# Altium schematic sheet Waveform Generator.SchDoc
size 406 x 304 mm; SheetNumber: 6; SheetTotal: 8
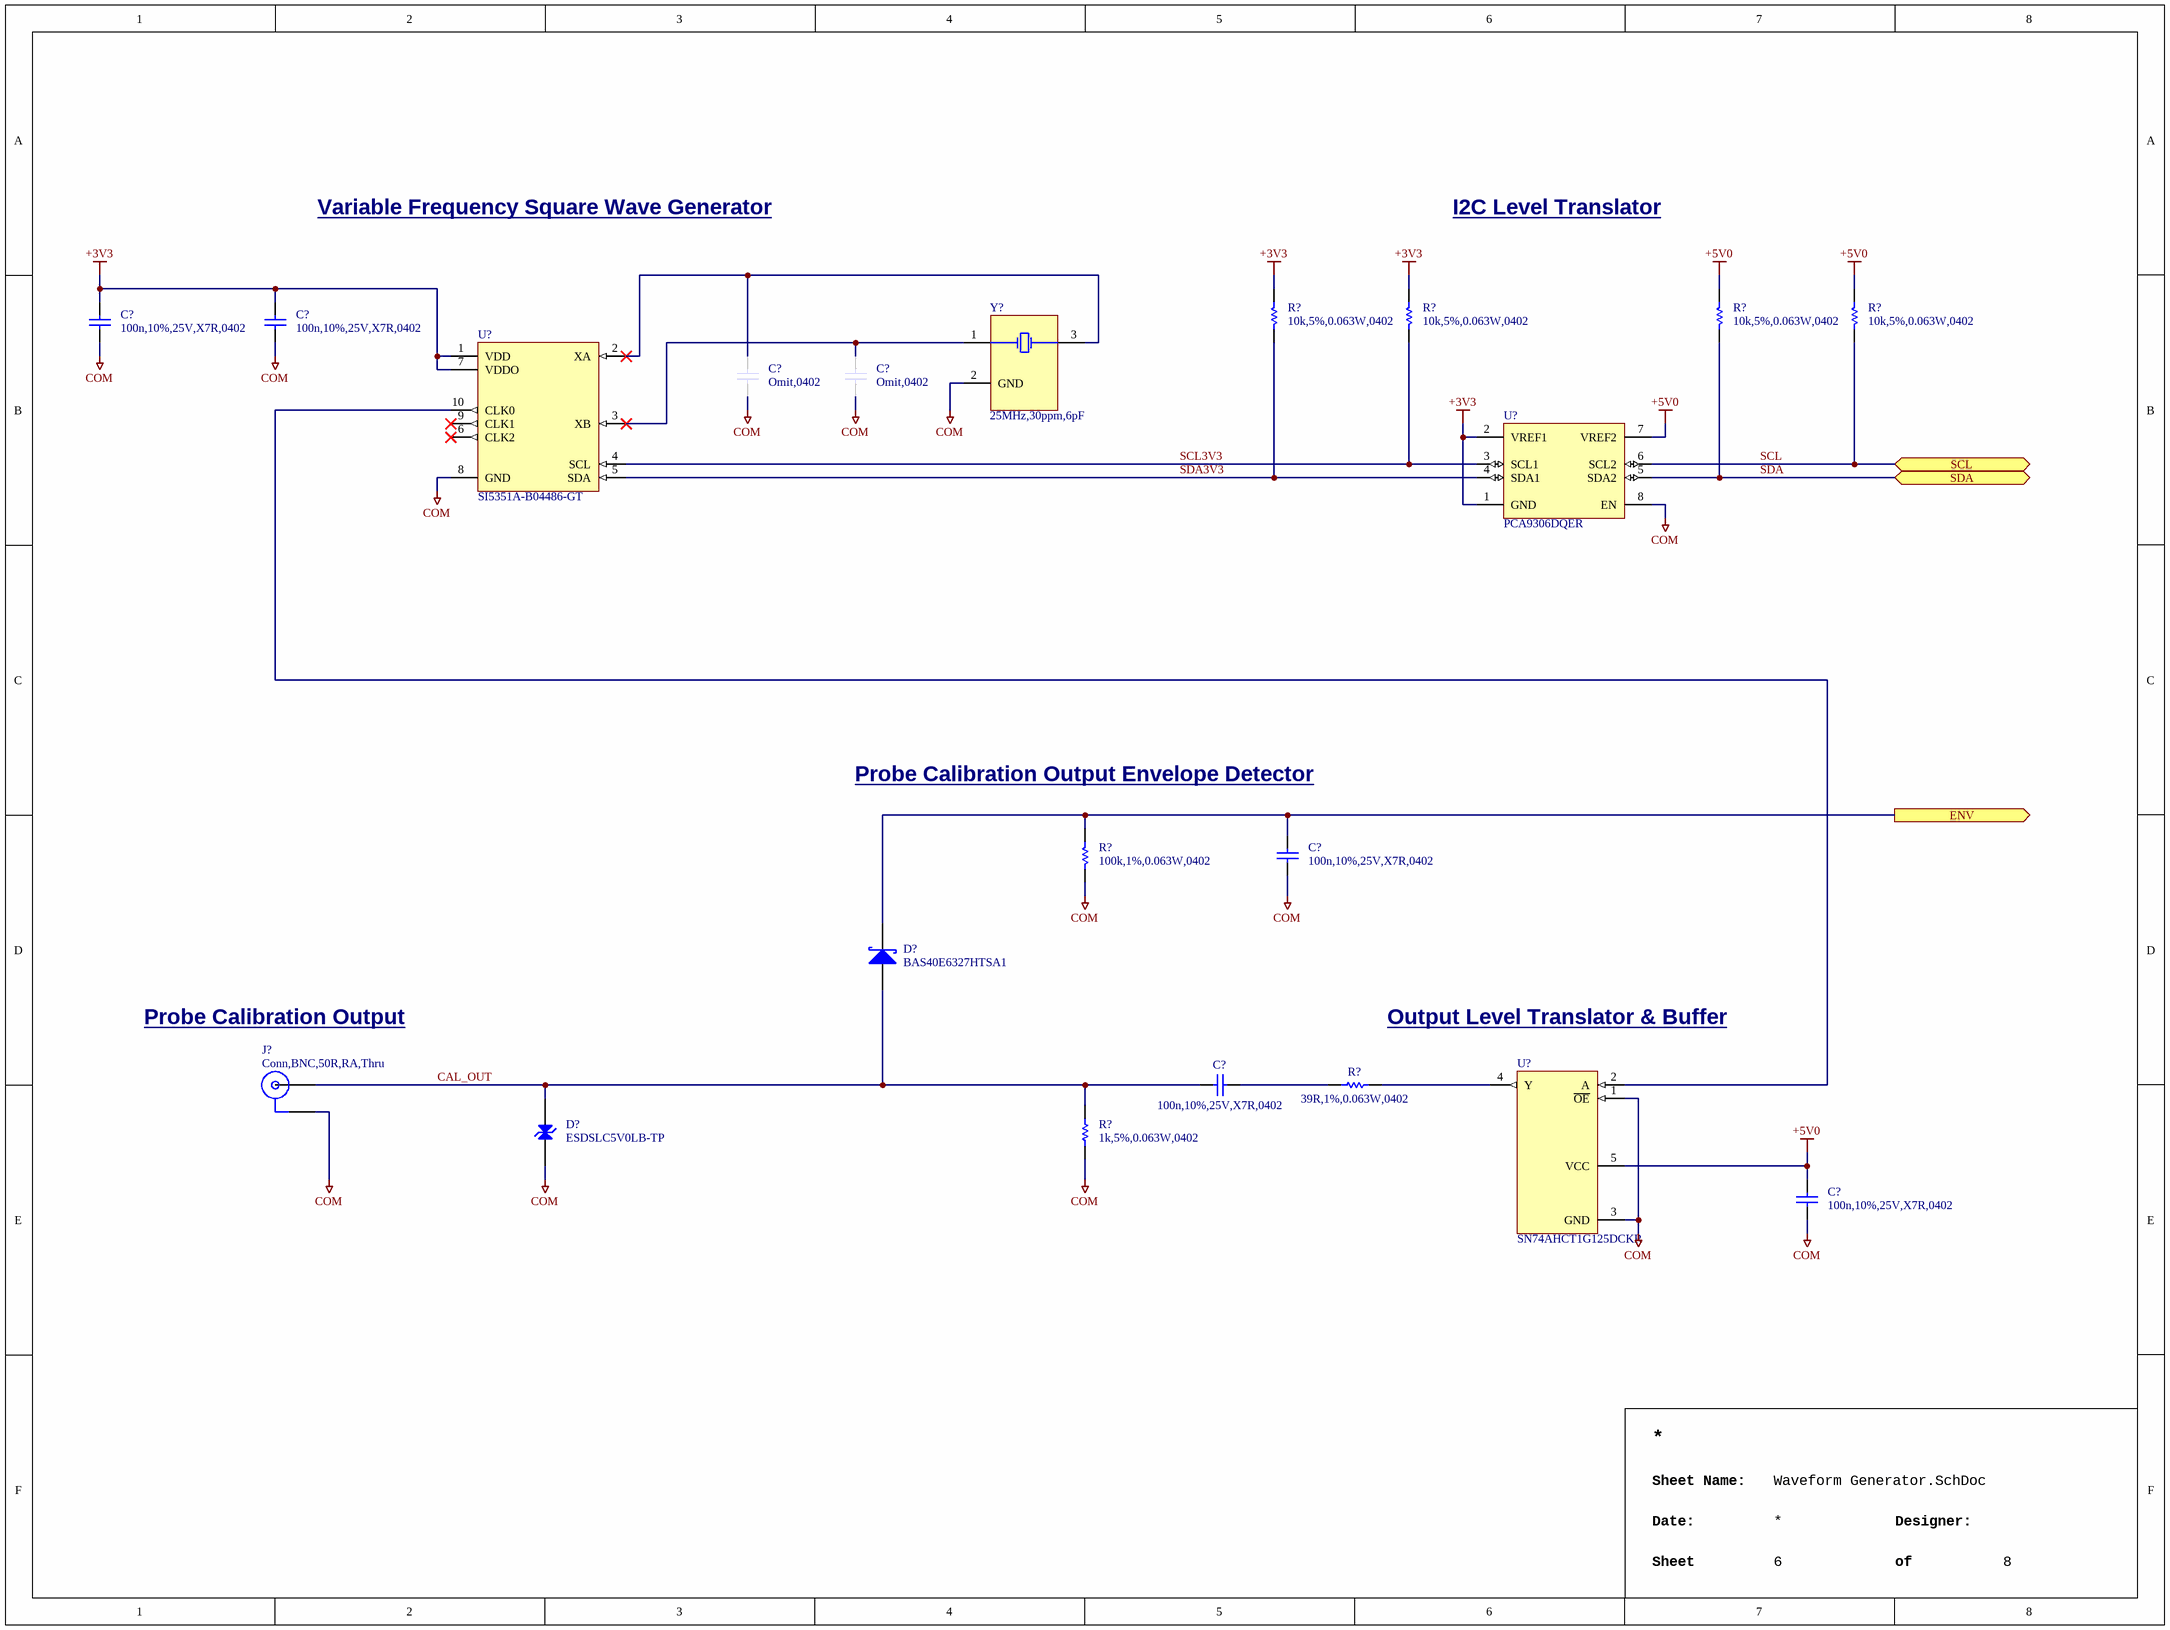
[diagram p0: Waveform Generator.SchDoc]

## Parts
(Parts that share a designator on the sheet are numbered #1, #2 ... from top to bottom, then left to right.)
C?#1  100n,10%,25V,X7R,0402  [CAPC1005X06N]
C?#2  100n,10%,25V,X7R,0402  [CAPC1005X06N]
C?#3  Omit,0402  [CAPC1005X06N]  (no BOM)
C?#4  Omit,0402  [CAPC1005X06N]  (no BOM)
C?#5  100n,10%,25V,X7R,0402  [CAPC1005X06N]
C?#6  100n,10%,25V,X7R,0402  [CAPC1005X06N]
C?#7  100n,10%,25V,X7R,0402  [CAPC1005X06N]
D?#1  BAS40E6327HTSA1  [INFINEON_PKG_SOT23]
D?#2  ESDSLC5V0LB-TP  [MICROCOMMERCIAL_DFN1006-2_NPOL]
J?  Conn,BNC,50R,RA,Thru  [TE-CONNECTIVITY_CONBNC002]
R?#1  10k,5%,0.063W,0402  [RESC1005X04N]
R?#2  10k,5%,0.063W,0402  [RESC1005X04N]
R?#3  10k,5%,0.063W,0402  [RESC1005X04N]
R?#4  10k,5%,0.063W,0402  [RESC1005X04N]
R?#5  100k,1%,0.063W,0402  [RESC1005X04N]
R?#6  39R,1%,0.063W,0402  [RESC1005X04N]
R?#7  1k,5%,0.063W,0402  [RESC1005X04N]
U?#1  SI5351A-B04486-GT  [SKYWORKS_10-MSOP]
U?#2  PCA9306DQER  [TEXASINSTRUMENTS_DQE0008A]
U?#3  SN74AHCT1G125DCKR  [TEXASINSTRUMENTS_PKG_DCK0005A]
Y?  25MHz,30ppm,6pF  [MURATA_PKG_XRCGB]

## Ports
ENV (out), SCL (bidir), SDA (bidir)

## Nets
+3V3: C?#1.2 C?#2.2 R?#1.2 R?#2.2 U?#1.1(VDD) U?#1.7(VDDO) U?#2.1(GND) U?#2.2(VREF1)
+5V0: C?#7.2 R?#3.2 R?#4.2 U?#2.7(VREF2) U?#3.5(VCC)
COM: C?#1.1 C?#2.1 C?#3.1 C?#4.1 C?#5.1 C?#7.1 D?#2.2(A) J?.2 R?#5.1 R?#7.1 U?#1.8(GND) U?#2.8(EN) U?#3.1(~{OE}) U?#3.3(GND) Y?.2(GND)
CAL_OUT: C?#6.2 D?#1.1(A) D?#2.1(K) J?.1 R?#7.2
ENV: C?#5.2 D?#1.3(K) R?#5.2 ; port ENV
SCL: R?#4.1 U?#2.6(SCL2) ; port SCL
SCL3V3: R?#2.1 U?#1.4(SCL) U?#2.3(SCL1)
SDA: R?#3.1 U?#2.5(SDA2) ; port SDA
SDA3V3: R?#1.1 U?#1.5(SDA) U?#2.4(SDA1)
NetC?#3_2: C?#3.2 U?#1.2(XA) Y?.3(GND)
NetC?#4_2: C?#4.2 U?#1.3(XB) Y?.1(OSC1)
NetC?#6_1: C?#6.1 R?#6.1
NetR?#6_2: R?#6.2 U?#3.4(Y)
NetU?#1_10: U?#1.10(CLK0) U?#3.2(A)

Not connected (* = marked no-connect by the designer): U?#1 6(CLK2)* 9(CLK1)*

## Notes on the sheet
- Variable Frequency Square Wave Generator
- I2C Level Translator
- Probe Calibration Output Envelope Detector
- Probe Calibration Output
- Output Level Translator & Buffer
- Sheet Name:
- Date:
- Sheet
- Designer:
- of

## Library data of the parts
C?#1 C?#2 C?#5-C?#7 = CAP,Cer,100nF,10%,25V,X7R,0402: 0.1ï¿½F ï¿½10% 25V Ceramic Capacitor X7R 0402 (1005 Metric); Manufacturer 1: Murata Electronics; Manufacturer 1 Part Number: GRM155R71E104KE14J; Vendor 1 Part Number: 490-14603-1-ND; Vendor 1: DigiKey; Value: 100nF; Part Name: CAP,Cer,100nF,10%,25V,X7R,0402; CreatedBy: Judd Foster; HelpURL: https://search.murata.co.jp/Ceramy/image/img/A01X/G101/ENG/GRM155R71E104KE14-01.pdf
C?#3 C?#4 = CAP,Omit,0402: Omit; Part Name: CAP,Omit,0402; CreatedBy: Judd Foster; HelpURL: N/A; Manufacturer 1: N/A; Manufacturer 1 Part Number: N/A; Vendor 1: N/A; Vendor 1 Part Number: N/A; Value: Omit
D?#1 = Diode,Schottky,40V,1A,SOT23: Diode 40 V 120mA Surface Mount PG-SOT23; Manufacturer 1: Infineon Technologies; Vendor 1 Part Number: BAS40E6327HTSA1CT-ND; Vendor 1: DigiKey; Part Name: Diode,Schottky,40V,1A,SOT23; CreatedBy: Judd Foster; HelpURL: https://rocelec.widen.net/view/pdf/ukzfofyli6/INFNS19700-1.pdf?t.download=true&u=5oefqw; Manufacturer 1 Part Number: BAS40E6327HTSA1
D?#2 = DIODE,TVS,5.0V,SOD882: 20V Clamp 4A (8/20ï¿½s) Ipp Tvs Diode Surface Mount 2-DFN1006; Manufacturer 1: Micro Commercial Co; Vendor 1 Part Number: ESDSLC5V0LB-TPMSCT-ND; Vendor 1: Digikey; Part Name: DIODE,TVS,5.0V,SOD882; CreatedBy: Judd Foster; HelpURL: https://www.mccsemi.com/pdf/Products/ESDSLC5V0LB(DFN1006-2).pdf; Manufacturer 1 Part Number: ESDSLC5V0LB-TP
J? = Conn,BNC,50R,RA,Thru: BNC Connector Jack, Female Socket 50 Ohms Panel Mount, Through Hole, Right Angle Solder; Manufacturer 1: TE Connectivity Linx; Manufacturer 1 Part Number: CONBNC002; Vendor 1 Part Number: 343-CONBNC002-ND; Vendor 1: DigiKey; Part Name: Conn,BNC,50R,RA,Thru; CreatedBy: Judd Foster; HelpURL: https://www.te.com/commerce/DocumentDelivery/DDEController?Action=srchrtrv&DocNm=CONBNC002&DocType=Data+Sheet&DocLang=English&DocFormat=pdf&PartCntxt=CONBNC002
R?#1-R?#4 = RES,10k,5%,0.063W,0402: 10 kOhms ï¿½5% 0.063W, 1/16W Chip Resistor 0402 (1005 Metric) Automotive AEC-Q200 Thick Film; Manufacturer 1: Stackpole Electronics Inc; Manufacturer 1 Part Number: RMCF0402JT10K0; Vendor 1 Part Number: RMCF0402JT10K0CT-ND; Vendor 1: DIgikey; Part Name: RES,10k,5%,0.063W,0402; CreatedBy: Judd Foster; HelpURL: https://www.seielect.com/catalog/sei-rmcf_rmcp.pdf; Value: 10k
R?#5 = RES,100k,1%,0.063W,0402: 100 kOhms Â±1% 0.063W, 1/16W Chip Resistor 0402 (1005 Metric) Moisture Resistant Thick Film; Manufacturer 1: YAGEO; Manufacturer 1 Part Number: RC0402FR-07100KL; Vendor 1 Part Number: 311-100KLRCT-ND; Vendor 1: DigiKey; Part Name: RES,100k,1%,0.063W,0402; CreatedBy: Judd Foster; HelpURL: https://www.yageo.com/upload/media/product/products/datasheet/rchip/PYu-RC_Group_51_RoHS_L_12.pdf; Value: 100k
R?#6 = RES,39R,1%,0.063W,0402: 39 Ohms ï¿½1% 0.063W, 1/16W Chip Resistor 0402 (1005 Metric) Moisture Resistant Thick Film; Manufacturer 1: YAGEO; Manufacturer 1 Part Number: RC0402FR-0739RL; Vendor 1 Part Number: 311-39.0LRCT-ND; Vendor 1: Digikey; Part Name: RES,39R,1%,0.063W,0402; CreatedBy: Judd Foster; HelpURL: https://www.yageo.com/upload/media/product/productsearch/datasheet/rchip/PYu-RC_Group_51_RoHS_L_12.pdf; Value: 39R
R?#7 = RES,1k,5%,0.063W,0402: 1 kOhms ï¿½5% 0.063W, 1/16W Chip Resistor 0402 (1005 Metric) Automotive AEC-Q200 Thick Film; Manufacturer 1: Stackpole Electronics Inc; Manufacturer 1 Part Number: RMCF0402JT1K00; Vendor 1 Part Number: RMCF0402JT1K00CT-ND; Vendor 1: DIgikey; Part Name: RES,1k,5%,0.063W,0402; CreatedBy: Judd Foster; HelpURL: https://www.seielect.com/catalog/sei-rmcf_rmcp.pdf; Value: 1k
U?#1 = SI5351A-B04486-GT: Clock Generator IC 200MHz 2 10-TFSOP, 10-MSOP (0.118", 3.00mm Width); Manufacturer 1: Skyworks Solutions Inc.; Vendor 1 Part Number: 336-3529-5-ND; Vendor 1: DigiKey; Part Name: SI5351A-B04486-GT; CreatedBy: Judd Foster; HelpURL: https://www.skyworksinc.com/-/media/Skyworks/SL/documents/public/data-sheets/Si5351-B.pdf; Manufacturer 1 Part Number: SI5351A-B04486-GT
U?#2 = PCA9306DQER: Voltage Level Translator Bidirectional 1 Circuit 2 Channel 8-X2SON (1.4x1); Manufacturer 1: Texas Instruments; Vendor 1 Part Number: 296-27957-1-ND; Vendor 1: Digikey; Part Name: PCA9306DQER; CreatedBy: Judd Foster; HelpURL: https://www.ti.com/lit/ds/symlink/pca9306.pdf?HQS=dis-dk-null-digikeymode-dsf-pf-null-wwe&ts=1705616121609&ref_url=https%253A%252F%252Fwww.ti.com%252Fgeneral%252Fdocs%252Fsuppproductinfo.tsp%253FdistId%253D10%2526gotoUrl%253Dhttps%253A%252F%252Fwww.ti.com; Manufacturer 1 Part Number: PCA9306DQER
U?#3 = SN74AHCT1G125DCKR: Buffer, Non-Inverting 1 Element 1 Bit per Element 3-State Output SC-70-5; Manufacturer 1: Texas Instruments; Vendor 1 Part Number: 296-4709-1-ND; Vendor 1: DigiKey; Part Name: SN74AHCT1G125DCKR; CreatedBy: Judd Foster; HelpURL: https://www.ti.com/lit/ds/symlink/sn74ahct1g125.pdf?HQS=dis-dk-null-digikeymode-dsf-pf-null-wwe&ts=1736760249757&ref_url=https%253A%252F%252Fwww.ti.com%252Fgeneral%252Fdocs%252Fsuppproductinfo.tsp%253FdistId%253D10%2526gotoUrl%253Dhttps%253A%252F%252Fwww.; Manufacturer 1 Part Number: SN74AHCT1G125DCKR
Y? = XTAL,25.0000MHz,30ppm,6pF,SMD: 25 MHz Â±30ppm Crystal 6pF 150 Ohms 4-SMD, No Lead; Manufacturer 1: Murata Electronics; Manufacturer 1 Part Number: XRCGB25M000F3M00R0; Vendor 1 Part Number: 490-5578-1-ND; Vendor 1: DigiKey; Part Name: XTAL,25.0000MHz,30ppm,6pF,SMD; CreatedBy: Judd Foster; HelpURL: https://www.murata.com/~/media/webrenewal/campaign/ads/america/timing/p79e.ashx?la=en-us; Value: 25MHz